# Altium schematic sheet gpiog-l.SchDoc
size A4; SheetNumber: 7; SheetTotal: 7
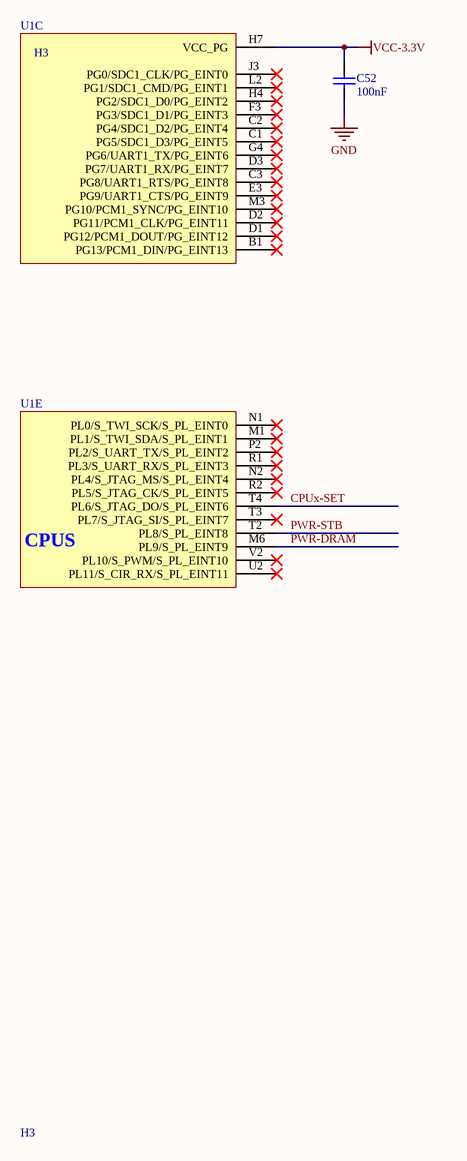
[diagram p0: gpiog-l.SchDoc]

## Parts
C52  100nF  [0402_C]
U1  H3  [allwinner-h3]  (parts C,E of 9)

## Nets
GND: C52.2
VCC-3.3V: C52.1 U1.H7(VCC_PG)
CPUx-SET: U1.T4(PL6/S_JTAG_DO/S_PL_EINT6)
PWR-DRAM: U1.M6(PL9/S_PL_EINT9)
PWR-STB: U1.T2(PL8/S_PL_EINT8)

Not connected (* = marked no-connect by the designer): U1 B1(PG13/PCM1_DIN/PG_EINT13)* C1(PG5/SDC1_D3/PG_EINT5)* C2(PG4/SDC1_D2/PG_EINT4)* C3(PG8/UART1_RTS/PG_EINT8)* D1(PG12/PCM1_DOUT/PG_EINT12)* D2(PG11/PCM1_CLK/PG_EINT11)* D3(PG7/UART1_RX/PG_EINT7)* E3(PG9/UART1_CTS/PG_EINT9)* F3(PG3/SDC1_D1/PG_EINT3)* G4(PG6/UART1_TX/PG_EINT6)* H4(PG2/SDC1_D0/PG_EINT2)* J3(PG0/SDC1_CLK/PG_EINT0)* L2(PG1/SDC1_CMD/PG_EINT1)* M1(PL1/S_TWI_SDA/S_PL_EINT1)* M3(PG10/PCM1_SYNC/PG_EINT10)* N1(PL0/S_TWI_SCK/S_PL_EINT0)* N2(PL4/S_JTAG_MS/S_PL_EINT4)* P2(PL2/S_UART_TX/S_PL_EINT2)* R1(PL3/S_UART_RX/S_PL_EINT3)* R2(PL5/S_JTAG_CK/S_PL_EINT5)* T3(PL7/S_JTAG_SI/S_PL_EINT7)* U2(PL11/S_CIR_RX/S_PL_EINT11)* V2(PL10/S_PWM/S_PL_EINT10)*

## Notes on the sheet
- (in symbol H3_CPU, part E) CPUS

## Library data of the parts
C52 = CAP-SMD: smd capacitor
U1 = H3_CPU: CPU